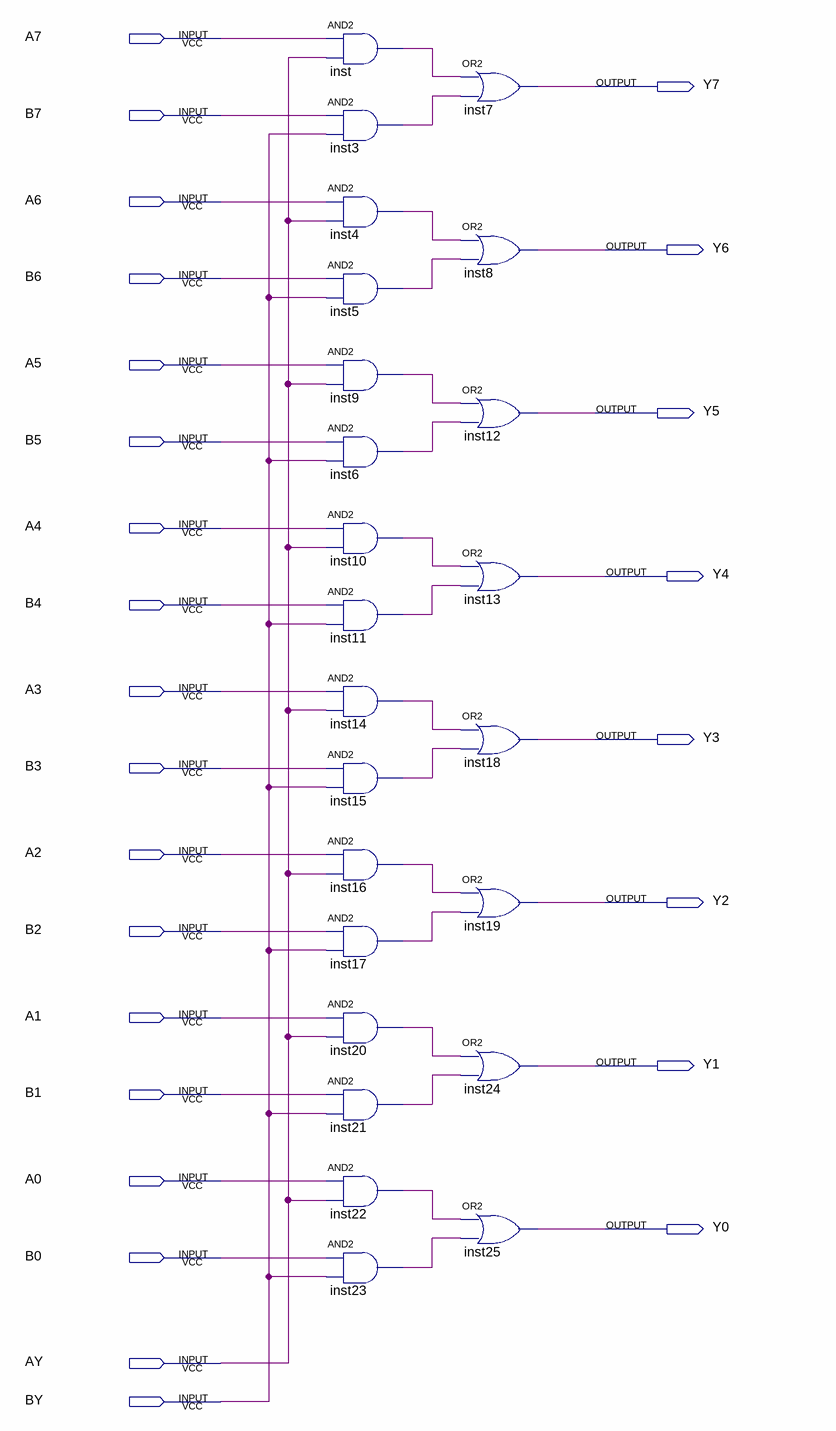
[diagram p0: schematic sheet]
// Quartus schematic mux2-8.bdf as structural Verilog: 24 symbols, 26 pins
module \mux2-8  (
  input  A7,
  input  B7,
  input  A6,
  input  B6,
  input  A5,
  input  B5,
  input  A4,
  input  B4,
  input  A3,
  input  B3,
  input  A2,
  input  B2,
  input  A1,
  input  B1,
  input  A0,
  input  B0,
  input  AY,
  input  BY,
  output Y7,
  output Y6,
  output Y5,
  output Y4,
  output Y3,
  output Y2,
  output Y1,
  output Y0
);

  wire inst3_out, inst4_out, inst5_out, inst6_out, inst9_out, inst10_out, inst11_out, inst14_out, inst15_out,
       inst16_out, inst17_out, inst20_out, inst21_out, inst22_out, inst23_out, inst_out;

  and inst (inst_out, A7, AY);
  and inst3 (inst3_out, B7, BY);
  and inst4 (inst4_out, A6, AY);
  and inst5 (inst5_out, B6, BY);
  and inst9 (inst9_out, A5, AY);
  and inst6 (inst6_out, B5, BY);
  and inst10 (inst10_out, A4, AY);
  and inst11 (inst11_out, B4, BY);
  and inst14 (inst14_out, A3, AY);
  and inst15 (inst15_out, B3, BY);
  and inst16 (inst16_out, A2, AY);
  and inst17 (inst17_out, B2, BY);
  and inst20 (inst20_out, A1, AY);
  and inst21 (inst21_out, B1, BY);
  and inst22 (inst22_out, A0, AY);
  and inst23 (inst23_out, B0, BY);
  or inst7 (Y7, inst_out, inst3_out);
  or inst8 (Y6, inst4_out, inst5_out);
  or inst12 (Y5, inst9_out, inst6_out);
  or inst13 (Y4, inst10_out, inst11_out);
  or inst18 (Y3, inst14_out, inst15_out);
  or inst19 (Y2, inst16_out, inst17_out);
  or inst24 (Y1, inst20_out, inst21_out);
  or inst25 (Y0, inst22_out, inst23_out);
endmodule
